# Altium project InfoDisplay.PrjPcb
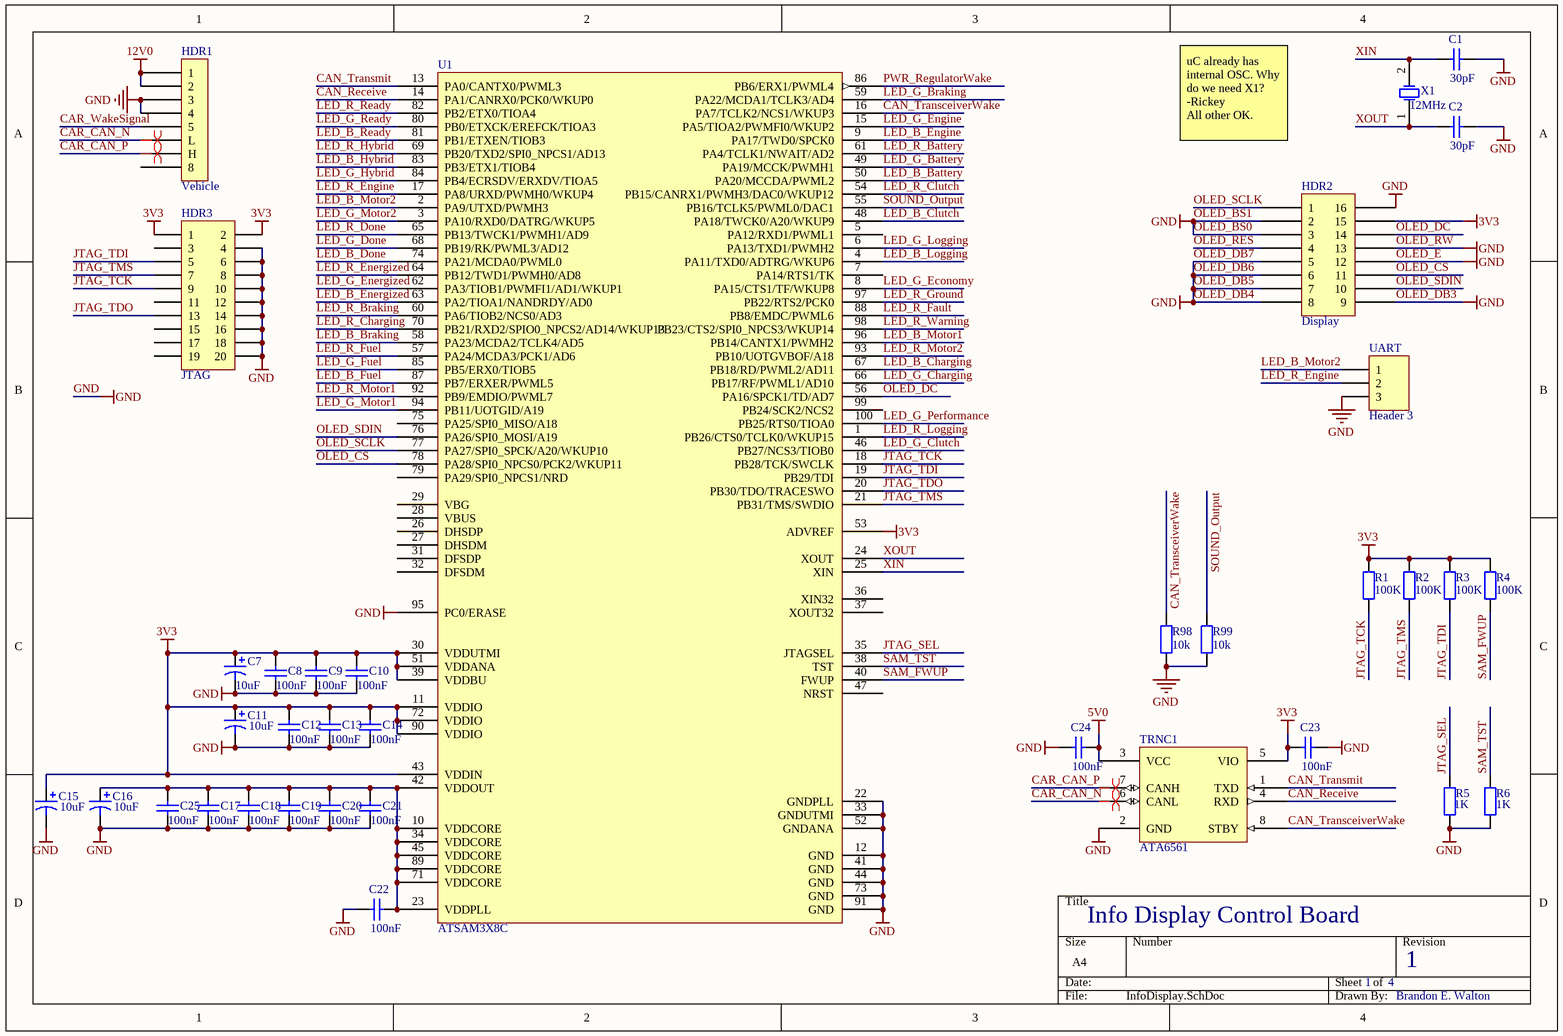
[diagram p0: InfoDisplay.SchDoc]
4 sheets, 219 parts. Net scope: global (net labels, ports and power ports of the same name join across sheets).
Board files: InfoDisplay.PcbDoc, InfoDisplayPreAutoRoute.PcbDoc, InfoDisplayPreReRoute.PcbDoc
Sheets:
  InfoDisplay.SchDoc
  InfoDisplayLEDs.SchDoc
  InfoDisplayAudio.SchDoc
  InfoDisplayPower.SchDoc

## Sheet InfoDisplay.SchDoc
size A4

### Parts
C1  value 30pF  [1608[0603]]  (hidden comment: CL10C300FB8NNNC)
C2  value 30pF  [1608[0603]]  (hidden comment: Cap)
C7  value 10uF  [CAPC3216M]  (hidden comment: Cap Pol1)
C8  value 100nF  [CAPC1608M]  (hidden comment: Cap)
C9  value 100nF  [CAPC1608M]  (hidden comment: Cap)
C10  value 100nF  [CAPC1608M]  (hidden comment: Cap)
C11  value 10uF  [CAPC3216M]  (hidden comment: Cap Pol1)
C12  value 100nF  [CAPC1608M]  (hidden comment: Cap)
C13  value 100nF  [CAPC1608M]  (hidden comment: Cap)
C14  value 100nF  [CAPC1608M]  (hidden comment: Cap)
C15  value 10uF  [CAPC3216M]  (hidden comment: Cap Pol1)
C16  value 10uF  [CAPC3216M]  (hidden comment: Cap Pol1)
C17  value 100nF  [CAPC1608M]  (hidden comment: Cap)
C18  value 100nF  [CAPC1608M]  (hidden comment: Cap)
C19  value 100nF  [CAPC1608M]  (hidden comment: Cap)
C20  value 100nF  [CAPC1608M]  (hidden comment: Cap)
C21  value 100nF  [CAPC1608M]  (hidden comment: Cap)
C22  value 100nF  [CAPC1608M]  (hidden comment: Cap)
C23  value 100nF  [CAPC1608M]  (hidden comment: Cap)
C24  value 100nF  [CAPC1608M]  (hidden comment: Cap)
C25  value 100nF  [CAPC1608M]  (hidden comment: Cap)
HDR1  Vehicle  [Molex_DuraClick_8Pin_Vertical]
HDR2  Display  [Molex_iGrid_16Pin_Vertical_Alt]
HDR3  JTAG  [HDR2X10]
R1  value 100K  [1608[0603]]  (hidden comment: Res2)
R2  value 100K  [1608[0603]]  (hidden comment: Res2)
R3  value 100K  [1608[0603]]  (hidden comment: Res2)
R4  value 100K  [1608[0603]]  (hidden comment: Res2)
R5  value 1K  [1608[0603]]  (hidden comment: Res2)
R6  value 1K  [1608[0603]]  (hidden comment: Res2)
R98  value 10k  [1608[0603]]  (hidden comment: RC0603JR-0710KL)
R99  value 10k  [1608[0603]]  (hidden comment: 311-10KGRCT-ND)
TRNC1  ATA6561  [SOP127P600X165-8M]
U1  ATSAM3X8C  [100-LQFP]
UART  Header 3  [HDR1X3]
X1  12MHz  [XTAL]

### Nets
3V3: C7.1 C8.1 C9.1 C10.1 C11.1 C12.1 C13.1 C14.1 C15.1 C23.2 HDR2.15 HDR3.1 HDR3.2 R1.2 R2.2 R3.2 R4.2 TRNC1.5(VIO) U1.11(VDDIO) U1.30(VDDUTMI) U1.39(VDDBU) U1.43(VDDIN) U1.51(VDDANA) U1.53(ADVREF) U1.72(VDDIO) U1.90(VDDIO)
5V0: C24.1 TRNC1.3(VCC)
12V0: HDR1.A1(1) HDR1.A2(2)
GND: C1.1 C2.1 C7.2 C8.2 C9.2 C10.2 C11.2 C12.2 C13.2 C14.2 C15.2 C16.2 C17.2 C18.2 C19.2 C20.2 C21.2 C22.2 C23.1 C24.2 C25.2 HDR1.A3(3) HDR1.A4(4) HDR2.2 HDR2.3 HDR2.5 HDR2.6 HDR2.7 HDR2.8 HDR2.9 HDR2.12 HDR2.13 HDR2.16 HDR3.4 HDR3.6 HDR3.8 HDR3.10 HDR3.12 HDR3.14 HDR3.16 HDR3.18 HDR3.20 R5.1 R6.1 R98.1 R99.1 TRNC1.2(GND) U1.12(GND) U1.22(GNDPLL) U1.33(GNDUTMI) U1.41(GND) U1.44(GND) U1.52(GNDANA) U1.73(GND) U1.91(GND) U1.95(PC0/ERASE) UART.3  [also labelled OLED_BS0, OLED_BS1, OLED_DB3, OLED_DB4, OLED_DB5, OLED_DB6, OLED_DB7, OLED_E, OLED_RW]
CAN_Receive: TRNC1.4(RXD) U1.14(PA1/CANRX0/PCK0/WKUP0)
CAN_TransceiverWake: R98.2 TRNC1.8(STBY) U1.16(PA7/TCLK2/NCS1/WKUP3)
CAN_Transmit: TRNC1.1(TXD) U1.13(PA0/CANTX0/PWML3)
CAR_CAN_N: HDR1.A6(L) TRNC1.6(CANL)
CAR_CAN_P: HDR1.A7(H) TRNC1.7(CANH)
CAR_WakeSignal: HDR1.A5(5)
JTAG_SEL: R5.2 U1.35(JTAGSEL)
JTAG_TCK: HDR3.9 R1.1 U1.18(PB28/TCK/SWCLK)
JTAG_TDI: HDR3.5 R3.1 U1.19(PB29/TDI)
JTAG_TDO: HDR3.13 U1.20(PB30/TDO/TRACESWO)
JTAG_TMS: HDR3.7 R2.1 U1.21(PB31/TMS/SWDIO)
LED_B_Battery: U1.50(PA20/MCCDA/PWML2)
LED_B_Braking: U1.58(PA23/MCDA2/TCLK4/AD5)
LED_B_Charging: U1.67(PB18/RD/PWML2/AD11)
LED_B_Clutch: U1.48(PA18/TWCK0/A20/WKUP9)
LED_B_Done: U1.74(PA21/MCDA0/PWML0)
LED_B_Energized: U1.63(PA2/TIOA1/NANDRDY/AD0)
LED_B_Engine: U1.9(PA17/TWD0/SPCK0)
LED_B_Fuel: U1.87(PB7/ERXER/PWML5)
LED_B_Hybrid: U1.83(PB3/ETX1/TIOB4)
LED_B_Logging: U1.4(PA11/TXD0/ADTRG/WKUP6)
LED_B_Motor1: U1.96(PB14/CANTX1/PWMH2)
LED_B_Motor2: U1.2(PA9/UTXD/PWMH3) UART.1
LED_B_Ready: U1.81(PB1/ETXEN/TIOB3)
LED_G_Battery: U1.49(PA19/MCCK/PWMH1)
LED_G_Braking: U1.59(PA22/MCDA1/TCLK3/AD4)
LED_G_Charging: U1.66(PB17/RF/PWML1/AD10)
LED_G_Clutch: U1.46(PB27/NCS3/TIOB0)
LED_G_Done: U1.68(PB19/RK/PWML3/AD12)
LED_G_Economy: U1.8(PA15/CTS1/TF/WKUP8)
LED_G_Energized: U1.62(PA3/TIOB1/PWMFI1/AD1/WKUP1)
LED_G_Engine: U1.15(PA5/TIOA2/PWMFI0/WKUP2)
LED_G_Fuel: U1.85(PB5/ERX0/TIOB5)
LED_G_Hybrid: U1.84(PB4/ECRSDV/ERXDV/TIOA5)
LED_G_Logging: U1.6(PA13/TXD1/PWMH2)
LED_G_Motor1: U1.94(PB11/UOTGID/A19)
LED_G_Motor2: U1.3(PA10/RXD0/DATRG/WKUP5)
LED_G_Performance: U1.100(PB25/RTS0/TIOA0)
LED_G_Ready: U1.80(PB0/ETXCK/EREFCK/TIOA3)
LED_R_Battery: U1.61(PA4/TCLK1/NWAIT/AD2)
LED_R_Braking: U1.60(PA6/TIOB2/NCS0/AD3)
LED_R_Charging: U1.70(PB21/RXD2/SPIO0_NPCS2/AD14/WKUP13)
LED_R_Clutch: U1.54(PB15/CANRX1/PWMH3/DAC0/WKUP12)
LED_R_Done: U1.65(PB13/TWCK1/PWMH1/AD9)
LED_R_Energized: U1.64(PB12/TWD1/PWMH0/AD8)
LED_R_Engine: U1.17(PA8/URXD/PWMH0/WKUP4) UART.2
LED_R_Fault: U1.88(PB8/EMDC/PWML6)
LED_R_Fuel: U1.57(PA24/MCDA3/PCK1/AD6)
LED_R_Ground: U1.97(PB22/RTS2/PCK0)
LED_R_Hybrid: U1.69(PB20/TXD2/SPI0_NPCS1/AD13)
LED_R_Logging: U1.1(PB26/CTS0/TCLK0/WKUP15)
LED_R_Motor1: U1.92(PB9/EMDIO/PWML7)
LED_R_Motor2: U1.93(PB10/UOTGVBOF/A18)
LED_R_Ready: U1.82(PB2/ETX0/TIOA4)
LED_R_Warning: U1.98(PB23/CTS2/SPI0_NPCS3/WKUP14)
OLED_CS: HDR2.11 U1.78(PA28/SPI0_NPCS0/PCK2/WKUP11)
OLED_DC: HDR2.14 U1.56(PA16/SPCK1/TD/AD7)
OLED_RES: HDR2.4
OLED_SCLK: HDR2.1 U1.77(PA27/SPI0_SPCK/A20/WKUP10)
OLED_SDIN: HDR2.10 U1.76(PA26/SPI0_MOSI/A19)
PWR_RegulatorWake: U1.86(PB6/ERX1/PWML4)
SAM_FWUP: R4.1 U1.40(FWUP)
SAM_TST: R6.2 U1.38(TST)
SOUND_Output: R99.2 U1.55(PB16/TCLK5/PWML0/DAC1)
XIN: C1.2 U1.25(XIN) X1.2(OSC2)
XOUT: C2.2 U1.24(XOUT) X1.1(OSC1)
NetC16_1: C16.1 C17.1 C18.1 C19.1 C20.1 C21.1 C22.1 C25.1 U1.10(VDDCORE) U1.23(VDDPLL) U1.34(VDDCORE) U1.42(VDDOUT) U1.45(VDDCORE) U1.71(VDDCORE) U1.89(VDDCORE)

Not connected (* = marked no-connect by the designer): HDR1 A8(8); HDR3 3 11 15 17 19; U1 5(PA12/RXD1/PWML1) 7(PA14/RTS1/TK) 26(DHSDP) 27(DHSDM) 28(VBUS) 29(VBG) 31(DFSDP) 32(DFSDM) 36(XIN32) 37(XOUT32) 47(NRST) 75(PA25/SPI0_MISO/A18) 79(PA29/SPI0_NPCS1/NRD) 99(PB24/SCK2/NCS2)

### Layout directives
differential pair: CAR_CAN_N, CAR_CAN_P

### Notes on the sheet
- uC already has internal OSC. Why do we need X1? -Rickey
  All other OK.
- Info Display Control Board
- 1
- 4
- Brandon E. Walton

### Library data of the parts
C1 = Cap: Capacitor; Published: 8-Jun-2000; LatestRevisionDate: 17-Jul-2002; LatestRevisionNote: Re-released for DXP Platform.; PackageReference: RAD-0.3; Publisher: Altium Limited; PackageDescription: Radial Cap, Thru-Hole; 2 Leads; 0.3 in Pin Spacing; Digikey: 1276-2259-1-ND; PartNumber: CL10C300FB8NNNC
C2 = Cap: Capacitor; PartNumber: CL10C300FB8NNNC; Published: 8-Jun-2000; LatestRevisionDate: 17-Jul-2002; LatestRevisionNote: Re-released for DXP Platform.; PackageReference: RAD-0.3; Publisher: Altium Limited; PackageDescription: Radial Cap, Thru-Hole; 2 Leads; 0.3 in Pin Spacing; Digikey: 1276-2259-1-ND; Manufacturer PartNo: CL10C300FB8NNNC
C7 C11 C16 = Cap Pol1: Polarized Capactior; Published: 8-Jun-2000; LatestRevisionDate: 17-Jul-2002; LatestRevisionNote: Re-released for DXP Platform.; PackageReference: RB7.6-15; Publisher: Altium Limited; PackageDescription: Polarized Capacitor (Radial); 2 Leads; Digikey: 495-2200-1-ND
C8-C10 C12-C14 C18-C25 = Cap: Capacitor; Partnumber: GRM188R71E104KA01D; Published: 8-Jun-2000; LatestRevisionDate: 17-Jul-2002; LatestRevisionNote: Re-released for DXP Platform.; PackageReference: RAD-0.3; Publisher: Altium Limited; PackageDescription: Radial Cap, Thru-Hole; 2 Leads; 0.3 in Pin Spacing; Digikey: 490-1524-1-ND
C15 = Cap Pol1: Polarized Capactior; PartNumber: T491A106K010ZT; Published: 8-Jun-2000; LatestRevisionDate: 17-Jul-2002; LatestRevisionNote: Re-released for DXP Platform.; PackageReference: RB7.6-15; Publisher: Altium Limited; PackageDescription: Polarized Capacitor (Radial); 2 Leads; Digikey: 495-2200-1-ND
C17 = Cap: Capacitor; PartNumber: GRM188R71E104KA01D; Published: 8-Jun-2000; LatestRevisionDate: 17-Jul-2002; LatestRevisionNote: Re-released for DXP Platform.; PackageReference: RAD-0.3; Publisher: Altium Limited; PackageDescription: Radial Cap, Thru-Hole; 2 Leads; 0.3 in Pin Spacing; Digikey: 490-1524-1-ND; Partnumber: GRM188R71E104KA01D
HDR1 = Molex_DuraClick_8Pin_Vertical: Molex iClick Series Connector, 8 Pin
HDR2 = Molex_iGrid_16Pin_Vertical: Molex iGrid Series Connector, 2 Row, 16 Pin
HDR3 = Header 10X2: JTAG Header, 10-Pin, Dual row, 2.56 pitch, Male; LatestRevisionDate: 17-Jul-2002; LatestRevisionNote: Re-released for DXP Platform.; Publisher: Altium Limited
R1-R4 = Res2: Resistor; PartNumber: MCT06030C1003FP500; Published: 8-Jun-2000; LatestRevisionDate: 17-Jul-2002; LatestRevisionNote: Re-released for DXP Platform.; PackageReference: AXIAL-0.4; Publisher: Altium Limited; PackageDescription: Axial Device, Thru-Hole; 2 Leads; 0.4 in Pin Spacing; Digikey: MCT0603-100K-CFCT-ND
R5 R6 = Res2: Resistor; PartNumber: MCT06030C1001FP500; Published: 8-Jun-2000; LatestRevisionDate: 17-Jul-2002; LatestRevisionNote: Re-released for DXP Platform.; PackageReference: AXIAL-0.4; Publisher: Altium Limited; PackageDescription: Axial Device, Thru-Hole; 2 Leads; 0.4 in Pin Spacing; Digikey: MCT0603-1.00K-CFCT-ND
R98 R99 = Res2: Resistor; Published: 8-Jun-2000; LatestRevisionDate: 17-Jul-2002; LatestRevisionNote: Re-released for DXP Platform.; PackageReference: AXIAL-0.4; Publisher: Altium Limited; PackageDescription: Axial Device, Thru-Hole; 2 Leads; 0.4 in Pin Spacing; Digikey: 311-10KGRCT-ND
TRNC1 = ATA6561: Atmel CAN Transceiver; Digikey: ATA6561; PartNumber: ATA6561
U1 = ATSAM3X8CA-AU: Atmel SAM Series Microcontroller; DigiKey: ATSAM3X8CA-AU-ND; PartNumber: ATSAM3X8CA-AU
UART = Header 3: Header, 3-Pin; LatestRevisionDate: 17-Jul-2002; LatestRevisionNote: Re-released for DXP Platform.; Publisher: Altium Limited
X1 = XTAL: 12MHz Crystal Oscillator; PartNumber: ECS-120-20-3X-EN-TR; Published: 8-Jun-2000; LatestRevisionDate: 17-Jul-2002; LatestRevisionNote: Re-released for DXP Platform.; PackageReference: R38; Publisher: Altium Limited; PackageDescription: Crystal, Thru-Hole; 2 Leads; Body 3.1 x 8.2 mm (Dia.xH); Digikey: XC1787CT-ND

## Sheet InfoDisplayLEDs.SchDoc
size A
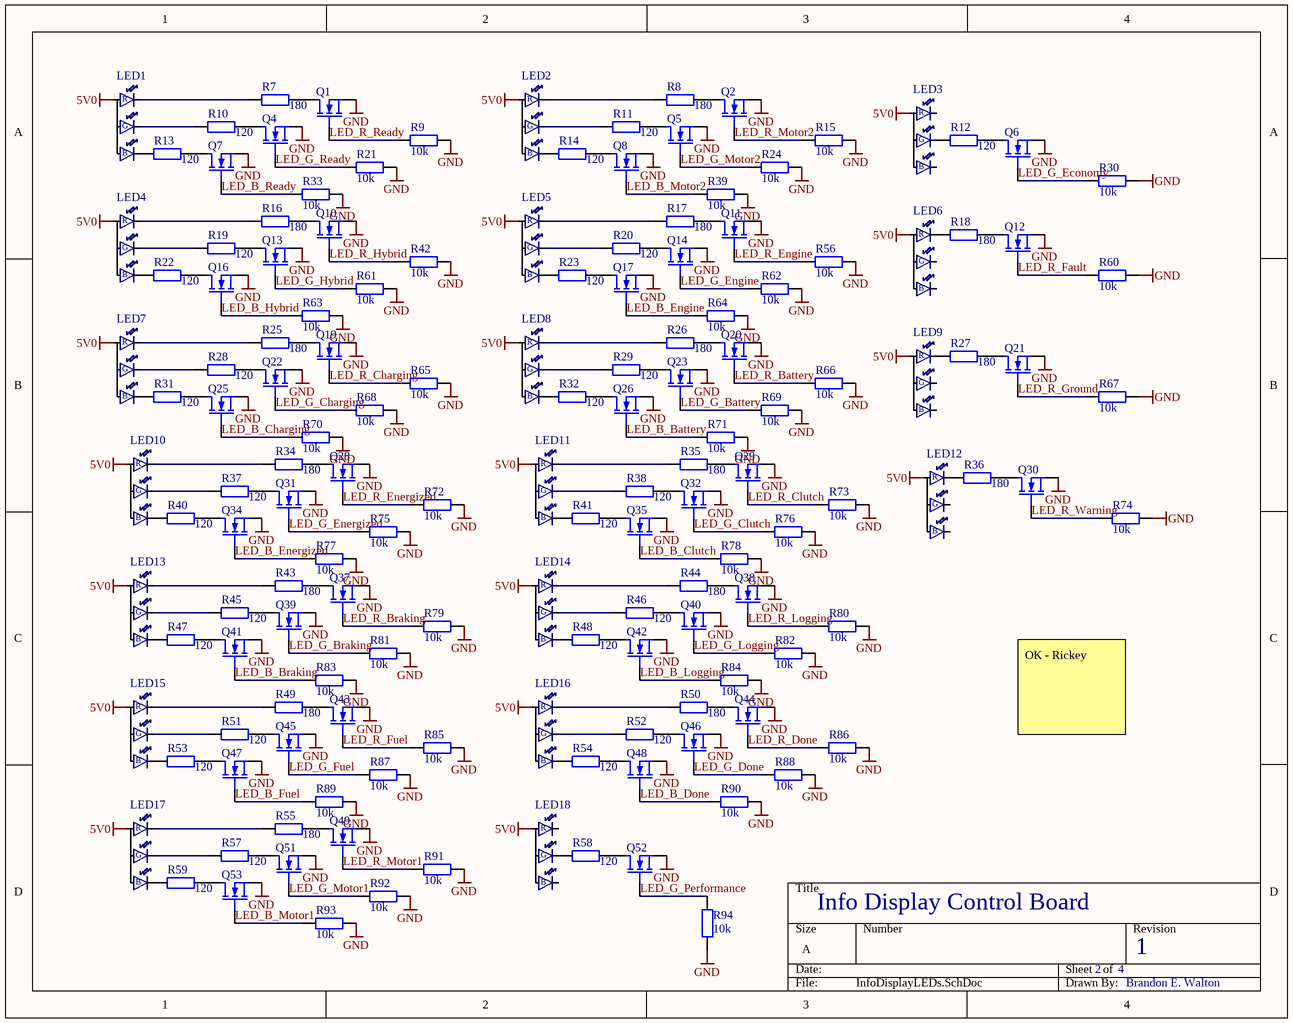
[diagram p1: InfoDisplayLEDs.SchDoc]

### Parts
LED1  LED  [CLVBA-FKA-CAEDH8BBB7A363CT-ND]  (value not drawn)
LED2  LED  [CLVBA-FKA-CAEDH8BBB7A363CT-ND]  (value not drawn)
LED3  LED  [CLVBA-FKA-CAEDH8BBB7A363CT-ND]  (value not drawn)
LED4  LED  [CLVBA-FKA-CAEDH8BBB7A363CT-ND]  (value not drawn)
LED5  LED  [CLVBA-FKA-CAEDH8BBB7A363CT-ND]  (value not drawn)
LED6  LED  [CLVBA-FKA-CAEDH8BBB7A363CT-ND]  (value not drawn)
LED7  LED  [CLVBA-FKA-CAEDH8BBB7A363CT-ND]  (value not drawn)
LED8  LED  [CLVBA-FKA-CAEDH8BBB7A363CT-ND]  (value not drawn)
LED9  LED  [CLVBA-FKA-CAEDH8BBB7A363CT-ND]  (value not drawn)
LED10  LED  [CLVBA-FKA-CAEDH8BBB7A363CT-ND]  (value not drawn)
LED11  LED  [CLVBA-FKA-CAEDH8BBB7A363CT-ND]  (value not drawn)
LED12  LED  [CLVBA-FKA-CAEDH8BBB7A363CT-ND]  (value not drawn)
LED13  LED  [CLVBA-FKA-CAEDH8BBB7A363CT-ND]  (value not drawn)
LED14  LED  [CLVBA-FKA-CAEDH8BBB7A363CT-ND]  (value not drawn)
LED15  LED  [CLVBA-FKA-CAEDH8BBB7A363CT-ND]  (value not drawn)
LED16  LED  [CLVBA-FKA-CAEDH8BBB7A363CT-ND]  (value not drawn)
LED17  LED  [CLVBA-FKA-CAEDH8BBB7A363CT-ND]  (value not drawn)
LED18  LED  [CLVBA-FKA-CAEDH8BBB7A363CT-ND]  (value not drawn)
Q1  MOSFET-N  [SOT50P160X110-3N]  (value not drawn)
Q2  MOSFET-N  [SOT50P160X110-3N]  (value not drawn)
Q4  MOSFET-N  [SOT50P160X110-3N]  (value not drawn)
Q5  MOSFET-N  [SOT50P160X110-3N]  (value not drawn)
Q6  MOSFET-N  [SOT50P160X110-3N]  (value not drawn)
Q7  MOSFET-N  [SOT50P160X110-3N]  (value not drawn)
Q8  MOSFET-N  [SOT50P160X110-3N]  (value not drawn)
Q10  MOSFET-N  [SOT50P160X110-3N]  (value not drawn)
Q11  MOSFET-N  [SOT50P160X110-3N]  (value not drawn)
Q12  MOSFET-N  [SOT50P160X110-3N]  (value not drawn)
Q13  MOSFET-N  [SOT50P160X110-3N]  (value not drawn)
Q14  MOSFET-N  [SOT50P160X110-3N]  (value not drawn)
Q16  MOSFET-N  [SOT50P160X110-3N]  (value not drawn)
Q17  MOSFET-N  [SOT50P160X110-3N]  (value not drawn)
Q19  MOSFET-N  [SOT50P160X110-3N]  (value not drawn)
Q20  MOSFET-N  [SOT50P160X110-3N]  (value not drawn)
Q21  MOSFET-N  [SOT50P160X110-3N]  (value not drawn)
Q22  MOSFET-N  [SOT50P160X110-3N]  (value not drawn)
Q23  MOSFET-N  [SOT50P160X110-3N]  (value not drawn)
Q25  MOSFET-N  [SOT50P160X110-3N]  (value not drawn)
Q26  MOSFET-N  [SOT50P160X110-3N]  (value not drawn)
Q28  MOSFET-N  [SOT50P160X110-3N]  (value not drawn)
Q29  MOSFET-N  [SOT50P160X110-3N]  (value not drawn)
Q30  MOSFET-N  [SOT50P160X110-3N]  (value not drawn)
Q31  MOSFET-N  [SOT50P160X110-3N]  (value not drawn)
Q32  MOSFET-N  [SOT50P160X110-3N]  (value not drawn)
Q34  MOSFET-N  [SOT50P160X110-3N]  (value not drawn)
Q35  MOSFET-N  [SOT50P160X110-3N]  (value not drawn)
Q37  MOSFET-N  [SOT50P160X110-3N]  (value not drawn)
Q38  MOSFET-N  [SOT50P160X110-3N]  (value not drawn)
Q39  MOSFET-N  [SOT50P160X110-3N]  (value not drawn)
Q40  MOSFET-N  [SOT50P160X110-3N]  (value not drawn)
Q41  MOSFET-N  [SOT50P160X110-3N]  (value not drawn)
Q42  MOSFET-N  [SOT50P160X110-3N]  (value not drawn)
Q43  MOSFET-N  [SOT50P160X110-3N]  (value not drawn)
Q44  MOSFET-N  [SOT50P160X110-3N]  (value not drawn)
Q45  MOSFET-N  [SOT50P160X110-3N]  (value not drawn)
Q46  MOSFET-N  [SOT50P160X110-3N]  (value not drawn)
Q47  MOSFET-N  [SOT50P160X110-3N]  (value not drawn)
Q48  MOSFET-N  [SOT50P160X110-3N]  (value not drawn)
Q49  MOSFET-N  [SOT50P160X110-3N]  (value not drawn)
Q51  MOSFET-N  [SOT50P160X110-3N]  (value not drawn)
Q52  MOSFET-N  [SOT50P160X110-3N]  (value not drawn)
Q53  MOSFET-N  [SOT50P160X110-3N]  (value not drawn)
R7  value 180  [1608[0603]]  (hidden comment: Res2)
R8  value 180  [1608[0603]]  (hidden comment: Res2)
R9  value 10k  [1608[0603]]  (hidden comment: 311-10KGRCT-ND)
R10  value 120  [1608[0603]]  (hidden comment: Res2)
R11  value 120  [1608[0603]]  (hidden comment: Res2)
R12  value 120  [1608[0603]]  (hidden comment: Res2)
R13  value 120  [1608[0603]]  (hidden comment: Res2)
R14  value 120  [1608[0603]]  (hidden comment: Res2)
R15  value 10k  [1608[0603]]  (hidden comment: 311-10KGRCT-ND)
R16  value 180  [1608[0603]]  (hidden comment: Res2)
R17  value 180  [1608[0603]]  (hidden comment: Res2)
R18  value 180  [1608[0603]]  (hidden comment: Res2)
R19  value 120  [1608[0603]]  (hidden comment: Res2)
R20  value 120  [1608[0603]]  (hidden comment: Res2)
R21  value 10k  [1608[0603]]  (hidden comment: 311-10KGRCT-ND)
R22  value 120  [1608[0603]]  (hidden comment: Res2)
R23  value 120  [1608[0603]]  (hidden comment: Res2)
R24  value 10k  [1608[0603]]  (hidden comment: 311-10KGRCT-ND)
R25  value 180  [1608[0603]]  (hidden comment: Res2)
R26  value 180  [1608[0603]]  (hidden comment: Res2)
R27  value 180  [1608[0603]]  (hidden comment: Res2)
R28  value 120  [1608[0603]]  (hidden comment: Res2)
R29  value 120  [1608[0603]]  (hidden comment: Res2)
R30  value 10k  [1608[0603]]  (hidden comment: 311-10KGRCT-ND)
R31  value 120  [1608[0603]]  (hidden comment: Res2)
R32  value 120  [1608[0603]]  (hidden comment: Res2)
R33  value 10k  [1608[0603]]  (hidden comment: 311-10KGRCT-ND)
R34  value 180  [1608[0603]]  (hidden comment: Res2)
R35  value 180  [1608[0603]]  (hidden comment: Res2)
R36  value 180  [1608[0603]]  (hidden comment: Res2)
R37  value 120  [1608[0603]]  (hidden comment: Res2)
R38  value 120  [1608[0603]]  (hidden comment: Res2)
R39  value 10k  [1608[0603]]  (hidden comment: 311-10KGRCT-ND)
R40  value 120  [1608[0603]]  (hidden comment: Res2)
R41  value 120  [1608[0603]]  (hidden comment: Res2)
R42  value 10k  [1608[0603]]  (hidden comment: 311-10KGRCT-ND)
R43  value 180  [1608[0603]]  (hidden comment: Res2)
R44  value 180  [1608[0603]]  (hidden comment: Res2)
R45  value 120  [1608[0603]]  (hidden comment: Res2)
R46  value 120  [1608[0603]]  (hidden comment: Res2)
R47  value 120  [1608[0603]]  (hidden comment: Res2)
R48  value 120  [1608[0603]]  (hidden comment: Res2)
R49  value 180  [1608[0603]]  (hidden comment: Res2)
R50  value 180  [1608[0603]]  (hidden comment: Res2)
R51  value 120  [1608[0603]]  (hidden comment: Res2)
R52  value 120  [1608[0603]]  (hidden comment: Res2)
R53  value 120  [1608[0603]]  (hidden comment: Res2)
R54  value 120  [1608[0603]]  (hidden comment: Res2)
R55  value 180  [1608[0603]]  (hidden comment: Res2)
R56  value 10k  [1608[0603]]  (hidden comment: 311-10KGRCT-ND)
R57  value 120  [1608[0603]]  (hidden comment: Res2)
R58  value 120  [1608[0603]]  (hidden comment: Res2)
R59  value 120  [1608[0603]]  (hidden comment: Res2)
R60  value 10k  [1608[0603]]  (hidden comment: 311-10KGRCT-ND)
R61  value 10k  [1608[0603]]  (hidden comment: 311-10KGRCT-ND)
R62  value 10k  [1608[0603]]  (hidden comment: 311-10KGRCT-ND)
R63  value 10k  [1608[0603]]  (hidden comment: 311-10KGRCT-ND)
R64  value 10k  [1608[0603]]  (hidden comment: 311-10KGRCT-ND)
R65  value 10k  [1608[0603]]  (hidden comment: 311-10KGRCT-ND)
R66  value 10k  [1608[0603]]  (hidden comment: 311-10KGRCT-ND)
R67  value 10k  [1608[0603]]  (hidden comment: 311-10KGRCT-ND)
R68  value 10k  [1608[0603]]  (hidden comment: 311-10KGRCT-ND)
R69  value 10k  [1608[0603]]  (hidden comment: 311-10KGRCT-ND)
R70  value 10k  [1608[0603]]  (hidden comment: 311-10KGRCT-ND)
R71  value 10k  [1608[0603]]  (hidden comment: 311-10KGRCT-ND)
R72  value 10k  [1608[0603]]  (hidden comment: 311-10KGRCT-ND)
R73  value 10k  [1608[0603]]  (hidden comment: 311-10KGRCT-ND)
R74  value 10k  [1608[0603]]  (hidden comment: 311-10KGRCT-ND)
R75  value 10k  [1608[0603]]  (hidden comment: 311-10KGRCT-ND)
R76  value 10k  [1608[0603]]  (hidden comment: 311-10KGRCT-ND)
R77  value 10k  [1608[0603]]  (hidden comment: 311-10KGRCT-ND)
R78  value 10k  [1608[0603]]  (hidden comment: 311-10KGRCT-ND)
R79  value 10k  [1608[0603]]  (hidden comment: 311-10KGRCT-ND)
R80  value 10k  [1608[0603]]  (hidden comment: 311-10KGRCT-ND)
R81  value 10k  [1608[0603]]  (hidden comment: 311-10KGRCT-ND)
R82  value 10k  [1608[0603]]  (hidden comment: 311-10KGRCT-ND)
R83  value 10k  [1608[0603]]  (hidden comment: 311-10KGRCT-ND)
R84  value 10k  [1608[0603]]  (hidden comment: 311-10KGRCT-ND)
R85  value 10k  [1608[0603]]  (hidden comment: 311-10KGRCT-ND)
R86  value 10k  [1608[0603]]  (hidden comment: 311-10KGRCT-ND)
R87  value 10k  [1608[0603]]  (hidden comment: 311-10KGRCT-ND)
R88  value 10k  [1608[0603]]  (hidden comment: 311-10KGRCT-ND)
R89  value 10k  [1608[0603]]  (hidden comment: 311-10KGRCT-ND)
R90  value 10k  [1608[0603]]  (hidden comment: 311-10KGRCT-ND)
R91  value 10k  [1608[0603]]  (hidden comment: 311-10KGRCT-ND)
R92  value 10k  [1608[0603]]  (hidden comment: 311-10KGRCT-ND)
R93  value 10k  [1608[0603]]  (hidden comment: 311-10KGRCT-ND)
R94  value 10k  [1608[0603]]  (hidden comment: 311-10KGRCT-ND)

### Nets
5V0: LED1.2(COMMON) LED2.2(COMMON) LED3.2(COMMON) LED4.2(COMMON) LED5.2(COMMON) LED6.2(COMMON) LED7.2(COMMON) LED8.2(COMMON) LED9.2(COMMON) LED10.2(COMMON) LED11.2(COMMON) LED12.2(COMMON) LED13.2(COMMON) LED14.2(COMMON) LED15.2(COMMON) LED16.2(COMMON) LED17.2(COMMON) LED18.2(COMMON)
GND: Q1.3(S) Q2.3(S) Q4.3(S) Q5.3(S) Q6.3(S) Q7.3(S) Q8.3(S) Q10.3(S) Q11.3(S) Q12.3(S) Q13.3(S) Q14.3(S) Q16.3(S) Q17.3(S) Q19.3(S) Q20.3(S) Q21.3(S) Q22.3(S) Q23.3(S) Q25.3(S) Q26.3(S) Q28.3(S) Q29.3(S) Q30.3(S) Q31.3(S) Q32.3(S) Q34.3(S) Q35.3(S) Q37.3(S) Q38.3(S) Q39.3(S) Q40.3(S) Q41.3(S) Q42.3(S) Q43.3(S) Q44.3(S) Q45.3(S) Q46.3(S) Q47.3(S) Q48.3(S) Q49.3(S) Q51.3(S) Q52.3(S) Q53.3(S) R9.2 R15.2 R21.2 R24.2 R30.1 R33.2 R39.2 R42.2 R56.2 R60.2 R61.2 R62.2 R63.2 R64.2 R65.2 R66.2 R67.2 R68.2 R69.2 R70.2 R71.2 R72.2 R73.2 R74.2 R75.2 R76.2 R77.2 R78.2 R79.2 R80.2 R81.2 R82.2 R83.2 R84.2 R85.2 R86.2 R87.2 R88.2 R89.2 R90.2 R91.2 R92.2 R93.2 R94.1
LED_B_Battery: Q26.2(G) R71.1
LED_B_Braking: Q41.2(G) R83.1
LED_B_Charging: Q25.2(G) R70.1
LED_B_Clutch: Q35.2(G) R78.1
LED_B_Done: Q48.2(G) R90.1
LED_B_Energized: Q34.2(G) R77.1
LED_B_Engine: Q17.2(G) R64.1
LED_B_Fuel: Q47.2(G) R89.1
LED_B_Hybrid: Q16.2(G) R63.1
LED_B_Logging: Q42.2(G) R84.1
LED_B_Motor1: Q53.2(G) R93.1
LED_B_Motor2: Q8.2(G) R39.1
LED_B_Ready: Q7.2(G) R33.1
LED_G_Battery: Q23.2(G) R69.1
LED_G_Braking: Q39.2(G) R81.1
LED_G_Charging: Q22.2(G) R68.1
LED_G_Clutch: Q32.2(G) R76.1
LED_G_Done: Q46.2(G) R88.1
LED_G_Economy: Q6.2(G) R30.2
LED_G_Energized: Q31.2(G) R75.1
LED_G_Engine: Q14.2(G) R62.1
LED_G_Fuel: Q45.2(G) R87.1
LED_G_Hybrid: Q13.2(G) R61.1
LED_G_Logging: Q40.2(G) R82.1
LED_G_Motor1: Q51.2(G) R92.1
LED_G_Motor2: Q5.2(G) R24.1
LED_G_Performance: Q52.2(G) R94.2
LED_G_Ready: Q4.2(G) R21.1
LED_R_Battery: Q20.2(G) R66.1
LED_R_Braking: Q37.2(G) R79.1
LED_R_Charging: Q19.2(G) R65.1
LED_R_Clutch: Q29.2(G) R73.1
LED_R_Done: Q44.2(G) R86.1
LED_R_Energized: Q28.2(G) R72.1
LED_R_Engine: Q11.2(G) R56.1
LED_R_Fault: Q12.2(G) R60.1
LED_R_Fuel: Q43.2(G) R85.1
LED_R_Ground: Q21.2(G) R67.1
LED_R_Hybrid: Q10.2(G) R42.1
LED_R_Logging: Q38.2(G) R80.1
LED_R_Motor1: Q49.2(G) R91.1
LED_R_Motor2: Q2.2(G) R15.1
LED_R_Ready: Q1.2(G) R9.1
LED_R_Warning: Q30.2(G) R74.1
NetLED1_1: LED1.1(RED) R7.2
NetLED1_3: LED1.3(BLUE) R13.2
NetLED1_4: LED1.4(GREEN) R10.2
NetLED2_1: LED2.1(RED) R8.2
NetLED2_3: LED2.3(BLUE) R14.2
NetLED2_4: LED2.4(GREEN) R11.2
NetLED3_4: LED3.4(GREEN) R12.2
NetLED4_1: LED4.1(RED) R16.2
NetLED4_3: LED4.3(BLUE) R22.2
NetLED4_4: LED4.4(GREEN) R19.2
NetLED5_1: LED5.1(RED) R17.2
NetLED5_3: LED5.3(BLUE) R23.2
NetLED5_4: LED5.4(GREEN) R20.2
NetLED6_1: LED6.1(RED) R18.2
NetLED7_1: LED7.1(RED) R25.2
NetLED7_3: LED7.3(BLUE) R31.2
NetLED7_4: LED7.4(GREEN) R28.2
NetLED8_1: LED8.1(RED) R26.2
NetLED8_3: LED8.3(BLUE) R32.2
NetLED8_4: LED8.4(GREEN) R29.2
NetLED9_1: LED9.1(RED) R27.2
NetLED10_1: LED10.1(RED) R34.2
NetLED10_3: LED10.3(BLUE) R40.2
NetLED10_4: LED10.4(GREEN) R37.2
NetLED11_1: LED11.1(RED) R35.2
NetLED11_3: LED11.3(BLUE) R41.2
NetLED11_4: LED11.4(GREEN) R38.2
NetLED12_1: LED12.1(RED) R36.2
NetLED13_1: LED13.1(RED) R43.2
NetLED13_3: LED13.3(BLUE) R47.2
NetLED13_4: LED13.4(GREEN) R45.2
NetLED14_1: LED14.1(RED) R44.2
NetLED14_3: LED14.3(BLUE) R48.2
NetLED14_4: LED14.4(GREEN) R46.2
NetLED15_1: LED15.1(RED) R49.2
NetLED15_3: LED15.3(BLUE) R53.2
NetLED15_4: LED15.4(GREEN) R51.2
NetLED16_1: LED16.1(RED) R50.2
NetLED16_3: LED16.3(BLUE) R54.2
NetLED16_4: LED16.4(GREEN) R52.2
NetLED17_1: LED17.1(RED) R55.2
NetLED17_3: LED17.3(BLUE) R59.2
NetLED17_4: LED17.4(GREEN) R57.2
NetLED18_4: LED18.4(GREEN) R58.2
NetQ1_1: Q1.1(D) R7.1
NetQ2_1: Q2.1(D) R8.1
NetQ4_1: Q4.1(D) R10.1
NetQ5_1: Q5.1(D) R11.1
NetQ6_1: Q6.1(D) R12.1
NetQ7_1: Q7.1(D) R13.1
NetQ8_1: Q8.1(D) R14.1
NetQ10_1: Q10.1(D) R16.1
NetQ11_1: Q11.1(D) R17.1
NetQ12_1: Q12.1(D) R18.1
NetQ13_1: Q13.1(D) R19.1
NetQ14_1: Q14.1(D) R20.1
NetQ16_1: Q16.1(D) R22.1
NetQ17_1: Q17.1(D) R23.1
NetQ19_1: Q19.1(D) R25.1
NetQ20_1: Q20.1(D) R26.1
NetQ21_1: Q21.1(D) R27.1
NetQ22_1: Q22.1(D) R28.1
NetQ23_1: Q23.1(D) R29.1
NetQ25_1: Q25.1(D) R31.1
NetQ26_1: Q26.1(D) R32.1
NetQ28_1: Q28.1(D) R34.1
NetQ29_1: Q29.1(D) R35.1
NetQ30_1: Q30.1(D) R36.1
NetQ31_1: Q31.1(D) R37.1
NetQ32_1: Q32.1(D) R38.1
NetQ34_1: Q34.1(D) R40.1
NetQ35_1: Q35.1(D) R41.1
NetQ37_1: Q37.1(D) R43.1
NetQ38_1: Q38.1(D) R44.1
NetQ39_1: Q39.1(D) R45.1
NetQ40_1: Q40.1(D) R46.1
NetQ41_1: Q41.1(D) R47.1
NetQ42_1: Q42.1(D) R48.1
NetQ43_1: Q43.1(D) R49.1
NetQ44_1: Q44.1(D) R50.1
NetQ45_1: Q45.1(D) R51.1
NetQ46_1: Q46.1(D) R52.1
NetQ47_1: Q47.1(D) R53.1
NetQ48_1: Q48.1(D) R54.1
NetQ49_1: Q49.1(D) R55.1
NetQ51_1: Q51.1(D) R57.1
NetQ52_1: Q52.1(D) R58.1
NetQ53_1: Q53.1(D) R59.1

Not connected (* = marked no-connect by the designer): LED3 1(RED) 3(BLUE); LED6 3(BLUE) 4(GREEN); LED9 3(BLUE) 4(GREEN); LED12 3(BLUE) 4(GREEN); LED18 1(RED) 3(BLUE)

### Notes on the sheet
- OK - Rickey
- Info Display Control Board
- 2
- 4
- 1
- Brandon E. Walton
- (in symbol LED) R; G; B

### Library data of the parts
LED1 = LED: LED RGB; PartNumber: CLVBA-FKA-CAEDH8BBB7A363; Digikey: CLVBA-FKA-CAEDH8BBB7A363CT-ND
Q1 Q2 Q4-Q8 Q10-Q14 Q16 Q17 Q19-Q23 Q25 Q26 Q28-Q31 Q34 Q35 Q37-Q49 Q51-Q53 = MOSFET-N: N-Channel MOSFET; Published: 8-Jun-2000; LatestRevisionDate: 17-Jul-2002; LatestRevisionNote: Re-released for DXP Platform.; PackageVersion: 1995/1996; PackageReference: E3; Publisher: Altium Limited; PackageDescription: TO, Flat Index; 3 In-Line, Axial Leads; Body Dia. 4.6mm; Lead Dia. 0.5 mm (max); Digikey: SSM3K15AFSLFCT-ND
Q32 = MOSFET-N: N-Channel MOSFET; PartNumber: SSM3K15AFS,LF; Published: 8-Jun-2000; LatestRevisionDate: 17-Jul-2002; LatestRevisionNote: Re-released for DXP Platform.; PackageVersion: 1995/1996; PackageReference: E3; Publisher: Altium Limited; PackageDescription: TO, Flat Index; 3 In-Line, Axial Leads; Body Dia. 4.6mm; Lead Dia. 0.5 mm (max); Digikey: SSM3K15AFSLFCT-ND
R7-R34 R36-R40 R42-R94 = Res2: Resistor; Published: 8-Jun-2000; LatestRevisionDate: 17-Jul-2002; LatestRevisionNote: Re-released for DXP Platform.; PackageReference: AXIAL-0.4; Publisher: Altium Limited; PackageDescription: Axial Device, Thru-Hole; 2 Leads; 0.4 in Pin Spacing
  R7 R8 R16-R18 R25-R27 R34 R36 R43 R44 R49 R50 R55: Digikey: RNCP0603FTD180RCT-ND
  R9 R15 R21 R24 R30 R33 R39 R42 R56 R60-R94: Digikey: 311-10KGRCT-ND
  R10-R14 R19 R20 R22 R23 R28 R29 R31 R32 R37 R38 R40 R45-R48 R51-R54 R57-R59: Digikey: 311-120GRCT-ND
R35 = Res2: Resistor; PartNumber: ESR03EZPJ101; Published: 8-Jun-2000; LatestRevisionDate: 17-Jul-2002; LatestRevisionNote: Re-released for DXP Platform.; PackageReference: AXIAL-0.4; Publisher: Altium Limited; PackageDescription: Axial Device, Thru-Hole; 2 Leads; 0.4 in Pin Spacing; Digikey: RNCP0603FTD180RCT-ND
R41 = Res2: Resistor; PartNumber: CRCW120622R0JNEA; Published: 8-Jun-2000; LatestRevisionDate: 17-Jul-2002; LatestRevisionNote: Re-released for DXP Platform.; PackageReference: AXIAL-0.4; Publisher: Altium Limited; PackageDescription: Axial Device, Thru-Hole; 2 Leads; 0.4 in Pin Spacing; Digikey: 311-120GRCT-ND
LED2-LED18 = LED: Digikey: CLVBA-FKA-CAEDH8BBB7A363CT-ND

## Sheet InfoDisplayAudio.SchDoc
size A
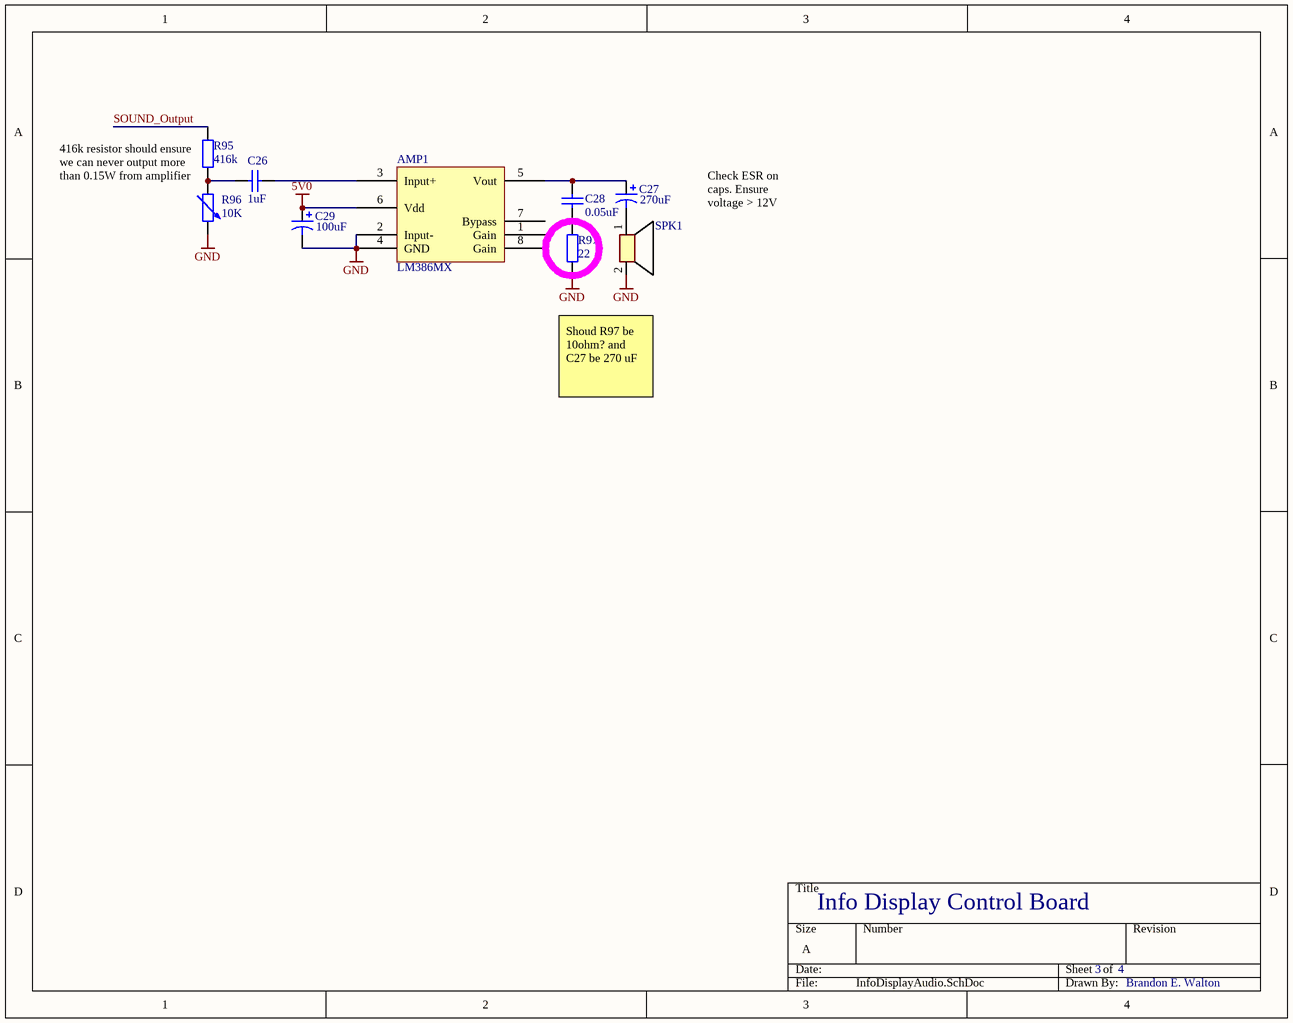
[diagram p2: InfoDisplayAudio.SchDoc]

### Parts
AMP1  LM386MX  [SOIC127P600X173-8N]
C26  value 1uF  [CAPC1005N]  (hidden comment: GRM155R60J105KE19D)
C27  value 270uF  [EEU-FR1A271]  (hidden comment: EEU-FR1A271)
C28  value 0.05uF  [RESC0603N]  (hidden comment: GRM033R61E472KA12D)
C29  value 100uF  [CAPC3216M]  (hidden comment: F930J107MAA)
R95  value 416k  [1608[0603]]  (hidden comment: RC0603FR-07422KL)
R96  value 10K  [PVZ3A103C01R00]  (hidden comment: PVZ3A103C01R00)
R97  value 22  [1608[0603]]  (hidden comment: Res2)
SPK1  PUI AST-03008MR-R  [AST-03008MR-R]  (value not drawn)

### Nets
5V0: AMP1.6(Vdd) C29.1
GND: AMP1.2(Input-) AMP1.4(GND) C29.2 R96.2 R97.2 SPK1.2
SOUND_Output: R95.2
NetAMP1_3: AMP1.3(Input+) C26.2
NetAMP1_5: AMP1.5(Vout) C27.1 C28.2
NetC26_1: C26.1 R95.1 R96.1
NetC27_2: C27.2 SPK1.1
NetC28_1: C28.1 R97.1

Not connected (* = marked no-connect by the designer): AMP1 1(Gain) 7(Bypass) 8(Gain)

### Notes on the sheet
- 416k resistor should ensure we can never output more than 0.15W from amplifier
- Check ESR on caps. Ensure voltage > 12V
- Shoud R97 be 10ohm? and C27 be 270 uF
- Info Display Control Board
- 3
- 4
- Brandon E. Walton

### Library data of the parts
AMP1 = LM386MX: TI Audio Amplifier, 0.350W, 5-12V; Partnumber: LM386MX-1/NOPB; Digikey: LM386MX-1/NOPBCT-ND
C26 C28 = Cap: Capacitor; Published: 8-Jun-2000; LatestRevisionDate: 17-Jul-2002; LatestRevisionNote: Re-released for DXP Platform.; PackageReference: RAD-0.3; Publisher: Altium Limited; PackageDescription: Radial Cap, Thru-Hole; 2 Leads; 0.3 in Pin Spacing
  C26: Digikey: 490-1320-1-ND; PartNumber: GRM155R60J105KE19D
  C28: Digikey: 490-9993-1-ND; PartNumber: GRM033R61E472KA12D
C27 C29 = Cap Pol1: Polarized Capactior; Published: 8-Jun-2000; LatestRevisionDate: 17-Jul-2002; LatestRevisionNote: Re-released for DXP Platform.; PackageReference: RB7.6-15; Publisher: Altium Limited; PackageDescription: Polarized Capacitor (Radial); 2 Leads
  C27: Digikey: P16745-ND; Partnumber: EEU-FR1A271
  C29: Digikey: 478-8155-1-ND; Partnumber: F930J107MAA
R95 = Res2: Resistor; Published: 8-Jun-2000; LatestRevisionDate: 17-Jul-2002; LatestRevisionNote: Re-released for DXP Platform.; PackageReference: AXIAL-0.4; Publisher: Altium Limited; PackageDescription: Axial Device, Thru-Hole; 2 Leads; 0.4 in Pin Spacing; Digikey: 311-422KHRCT-ND; Partnumber: RC0603FR-07422KL
R96 = Res Adj2: Variable Resistor; Set Position: 0.5; Published: 8-Jun-2000; LatestRevisionDate: 17-Jul-2002; LatestRevisionNote: Re-released for DXP Platform.; PackageReference: AXIAL-0.6; Publisher: Altium Limited; PackageDescription: Axial Device, Thru-Hole; 2 Leads; 0.6 in Pin Spacing; Digikey: 490-7005-1-ND; Partnumber: PVZ3A103C01R00
R97 = Res2: Resistor; PartNumber: CRCW120622R0JNEA; Published: 8-Jun-2000; LatestRevisionDate: 17-Jul-2002; LatestRevisionNote: Re-released for DXP Platform.; PackageReference: AXIAL-0.4; Publisher: Altium Limited; PackageDescription: Axial Device, Thru-Hole; 2 Leads; 0.4 in Pin Spacing; Digikey: 541-22ECT-ND
SPK1 = PUI AST-03008MR-R: PUI 0.15W Speaker, 8 Ohm; Digikey: 668-1136-ND; Partnumber: AST-03008MR-R

## Sheet InfoDisplayPower.SchDoc
size A
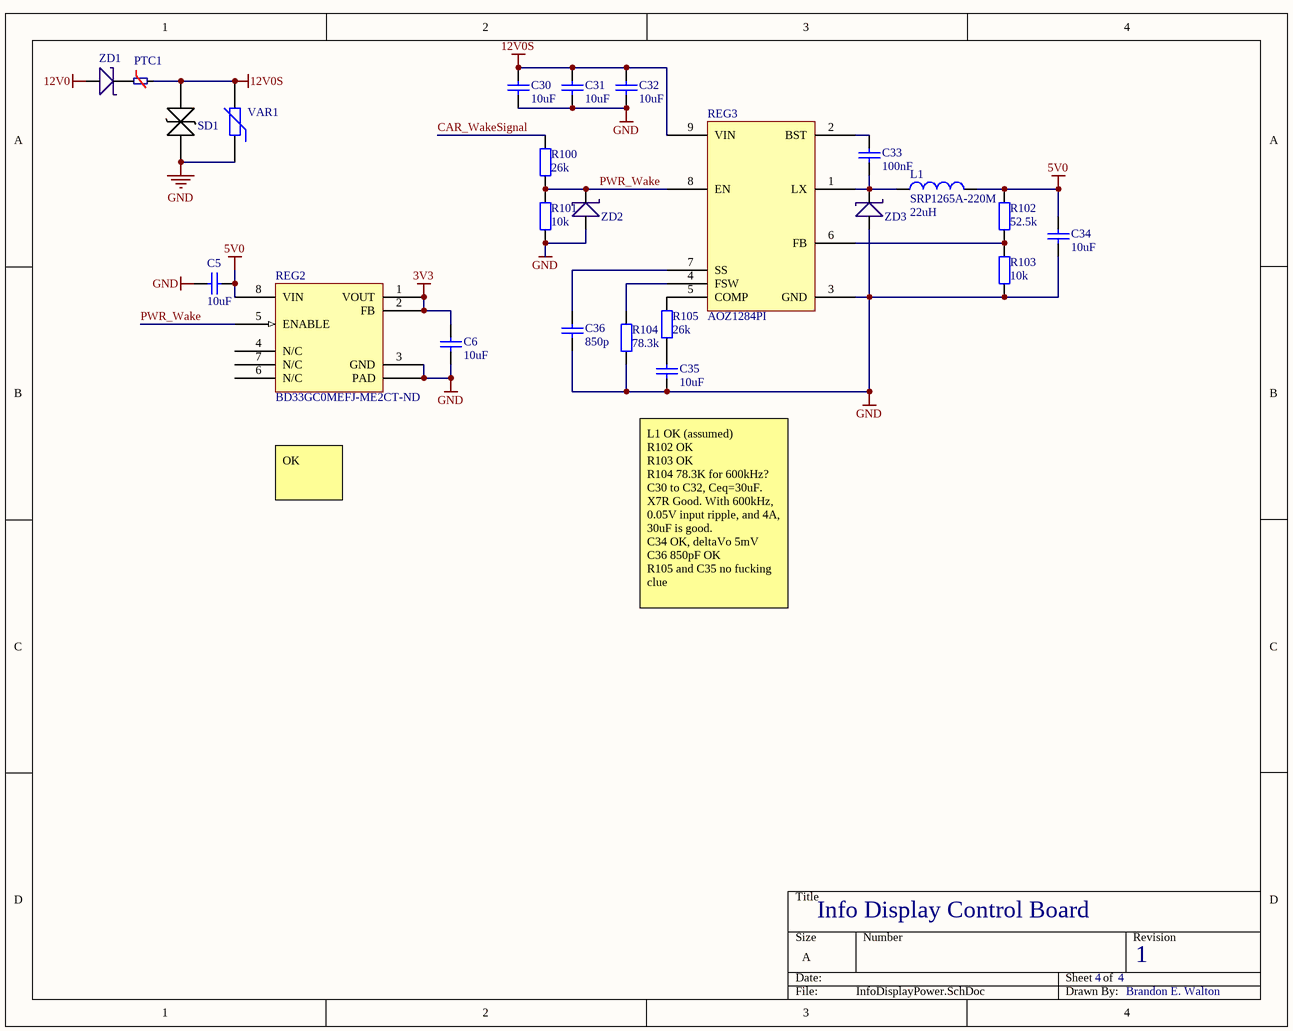
[diagram p3: InfoDisplayPower.SchDoc]

### Parts
C5  value 10uF  [CAPC3216M]  (hidden comment: CGA5L1X7R1E106K160AC)
C6  value 10uF  [CAPC3216M]  (hidden comment: CGA5L1X7R1E106K160AC)
C30  value 10uF  [CAPC3216M]  (hidden comment: CGA5L1X7R1E106K160AC)
C31  value 10uF  [CAPC3216M]  (hidden comment: CGA5L1X7R1E106K160AC)
C32  value 10uF  [CAPC3216M]  (hidden comment: CGA5L1X7R1E106K160AC)
C33  value 100nF  [CAPC1005M]  (hidden comment: GRM155R71C104KA88D)
C34  value 10uF  [CAPC3216M]  (hidden comment: CGA5L1X7R1E106K160AC)
C35  value 10uF  [CAPC3216M]  (hidden comment: CGA5L1X7R1E106K160AC)
C36  value 850p  [RESC0603L]  (hidden comment: GRM033R71E821KA01D)
L1  SRP1265A-220M  value 22uH  [SRP1265A-220M]
PTC1  0ZCF0200AF2C  [0ZCF0200AF2C]  (value not drawn)
R100  value 26k  [1608[0603]]  (hidden comment: MCT06030C2702FP500)
R101  value 10k  [1608[0603]]  (hidden comment: RC0603JR-0710KL)
R102  value 52.5k  [1608[0603]]  (hidden comment: RC0603FR-0752K3L)
R103  value 10k  [1608[0603]]  (hidden comment: RC0603JR-0710KL)
R104  value 78.3k  [RESC1005L]  (hidden comment: RC0402FR-0778K7L)
R105  value 26k  [1608[0603]]  (hidden comment: MCT06030C2702FP500)
REG2  BD33GC0MEFJ-ME2CT-ND  [TSOP127P600X100_HS-9M]
REG3  AOZ1284PI  [SOIC127P600X170_HS-9N]
SD1  UCLAMP1211P.TCT  [CAPC1005M]  (value not drawn)
VAR1  V10P14AUTO  [AXIAL-0.3]  (value not drawn)
ZD1  DB2430100L  [DB2430100L]  (value not drawn)
ZD2  MM3Z3V3ST1G  [SOIC127P250X100-2N]  (value not drawn)
ZD3  DB2431200L  [DB2431200L]  (value not drawn)

### Nets
3V3: C6.1 REG2.1(VOUT) REG2.2(FB)
5V0: C5.2 C34.1 L1.2 R102.2 REG2.8(VIN)
12V0: ZD1.A
12V0S: C30.1 C31.1 C32.1 PTC1.2 REG3.9(VIN) SD1.2 VAR1.2
GND: C5.1 C6.2 C30.2 C31.2 C32.2 C34.2 C35.2 C36.2 R101.1 R103.1 R104.1 REG2.3(GND) REG2.9(PAD) REG3.3(GND) SD1.1 VAR1.1 ZD2.A ZD3.A
CAR_WakeSignal: R100.2
PWR_Wake: R100.1 R101.2 REG2.5(ENABLE) REG3.8(EN) ZD2.K
NetC33_1: C33.1 REG3.2(BST)
NetC33_2: C33.2 L1.1 REG3.1(LX) ZD3.K
NetC35_1: C35.1 R105.1
NetC36_1: C36.1 REG3.7(SS)
NetPTC1_1: PTC1.1 ZD1.K
NetR102_1: R102.1 R103.2 REG3.6(FB)
NetR104_2: R104.2 REG3.4(FSW)
NetR105_2: R105.2 REG3.5(COMP)

Not connected (* = marked no-connect by the designer): REG2 4(N/C) 6(N/C) 7(N/C)

### Notes on the sheet
- OK
- (near C35) L1 OK (assumed)
  R102 OK
  R103 OK
  R104 78.3K for 600kHz?
  C30 to C32, Ceq=30uF. X7R Good. With 600kHz, 0.05V input ripple, and 4A, 30uF is good.
  C34 OK, deltaVo 5mV
  C36 850pF OK
  R105 and C35 no fucking clue
- Info Display Control Board
- 4
- 1
- Brandon E. Walton

### Library data of the parts
C5 C6 C30-C35 = Cap: Capacitor; Published: 8-Jun-2000; LatestRevisionDate: 17-Jul-2002; LatestRevisionNote: Re-released for DXP Platform.; PackageReference: RAD-0.3; Publisher: Altium Limited; PackageDescription: Radial Cap, Thru-Hole; 2 Leads; 0.3 in Pin Spacing
  C5 C6 C30-C32 C34 C35: Digikey: 445-6990-1-ND; PartNumber: CGA5L1X7R1E106K160AC
  C33: Digikey: 490-3261-1-ND; PartNumber: GRM155R71C104KA88D
C36 = Cap: Capacitor; PartNumber: CGA5L1X7R1E106K160AC; Published: 8-Jun-2000; LatestRevisionDate: 17-Jul-2002; LatestRevisionNote: Re-released for DXP Platform.; PackageReference: RAD-0.3; Publisher: Altium Limited; PackageDescription: Radial Cap, Thru-Hole; 2 Leads; 0.3 in Pin Spacing; Digikey: 490-3183-1-ND
L1 = Inductor: Code_IEC: 1005; Published: 8-Jun-2000; LatestRevisionDate: 29-May-2009; LatestRevisionNote: IPC-7351 Footprint Added.; PackageReference: 0402-A; Publisher: Altium Limited; PackageDescription: Chip Inductor; Code_JEITA: 0402; Digikey: SRP1265A-220MCT-ND; Partnumber: SRP1265A-220M
PTC1 = 0ZCF0200AF2C: PTC device, 2A hold, 4A trip; Digikey: 507-1749-1-ND; Manufacturer PartNo: 0ZCF0200AF2C
R100-R105 = Res2: Resistor; Partnumber: RC0603FR-07422KL; Published: 8-Jun-2000; LatestRevisionDate: 17-Jul-2002; LatestRevisionNote: Re-released for DXP Platform.; PackageReference: AXIAL-0.4; Publisher: Altium Limited; PackageDescription: Axial Device, Thru-Hole; 2 Leads; 0.4 in Pin Spacing
  R100 R105: Digikey: MCT0603-27.0K-CFCT-ND
  R101 R103: Digikey: 311-10KGRCT-ND
  R102: Digikey: 311-52.3KHRCT-ND
  R104: Digikey: 311-78.7KLRCT-ND
REG2 = BD33GC0MEFJ-ME2CT-ND: Rohm 3.3V LDO; Digikey: BD33GC0MEFJ-ME2CT-ND; Partnumber: BD33GC0MEFJ-ME2
REG3 = AOZ1284PI: A&M 4A Buck Regulator, 0.8 to 30V; Manufacturer PartNo: AOZ1284PI; Digikey: 785-1689-1-ND
SD1 = UCLAMP0511PQTCT: Semtech TVS Diode; Digikey: UCLAMP1211PCT-ND; PartNumber: UCLAMP1211P.TCT
VAR1 = Res Varistor: Varistor (Voltage-Sensitive Resistor); Published: 24-Mar-1999; LatestRevisionDate: 29-May-2009; LatestRevisionNote: IPC-7351 Footprint Added.; PackageVersion: Mar-2003; PackageReference: 6-0805; Publisher: Altium Limited; PackageDescription: Chip Resistor 0805 Case Size; Code_IPC: RESC2012; Digikey: F6413-ND; Partnumber: V10P14AUTO
ZD1 = DB2430100L: Panasonic Schottky Diode, 2A; Digikey: DB2430100LCT-ND; Partnumber: DB2430100L
ZD2 = DB2430100L: 3.3V Zener Diode; Digikey: MM3Z3V3ST1GOSCT-ND; Partnumber: MM3Z3V3ST1G
ZD3 = DB2430100L: Shottky Diode, 5A, 30V, 510 mV; Digikey: DB2431200LCT-ND; Partnumber: DB2431200L

## Nets that join several sheets
3V3: InfoDisplay (26 pins), InfoDisplayPower (C6.1 REG2.1 REG2.2)
5V0: InfoDisplay (C24.1 TRNC1.3), InfoDisplayLEDs (18 pins), InfoDisplayAudio (AMP1.6 C29.1), InfoDisplayPower (5 pins)
12V0: InfoDisplay (HDR1.A1 HDR1.A2), InfoDisplayPower (ZD1.A)
GND: InfoDisplay (57 pins), InfoDisplayLEDs (88 pins), InfoDisplayAudio (6 pins), InfoDisplayPower (18 pins)
CAR_WakeSignal: InfoDisplay (HDR1.A5), InfoDisplayPower (R100.2)
LED_B_Battery: InfoDisplay (U1.50), InfoDisplayLEDs (Q26.2 R71.1)
LED_B_Braking: InfoDisplay (U1.58), InfoDisplayLEDs (Q41.2 R83.1)
LED_B_Charging: InfoDisplay (U1.67), InfoDisplayLEDs (Q25.2 R70.1)
LED_B_Clutch: InfoDisplay (U1.48), InfoDisplayLEDs (Q35.2 R78.1)
LED_B_Done: InfoDisplay (U1.74), InfoDisplayLEDs (Q48.2 R90.1)
LED_B_Energized: InfoDisplay (U1.63), InfoDisplayLEDs (Q34.2 R77.1)
LED_B_Engine: InfoDisplay (U1.9), InfoDisplayLEDs (Q17.2 R64.1)
LED_B_Fuel: InfoDisplay (U1.87), InfoDisplayLEDs (Q47.2 R89.1)
LED_B_Hybrid: InfoDisplay (U1.83), InfoDisplayLEDs (Q16.2 R63.1)
LED_B_Logging: InfoDisplay (U1.4), InfoDisplayLEDs (Q42.2 R84.1)
LED_B_Motor1: InfoDisplay (U1.96), InfoDisplayLEDs (Q53.2 R93.1)
LED_B_Motor2: InfoDisplay (U1.2 UART.1), InfoDisplayLEDs (Q8.2 R39.1)
LED_B_Ready: InfoDisplay (U1.81), InfoDisplayLEDs (Q7.2 R33.1)
LED_G_Battery: InfoDisplay (U1.49), InfoDisplayLEDs (Q23.2 R69.1)
LED_G_Braking: InfoDisplay (U1.59), InfoDisplayLEDs (Q39.2 R81.1)
LED_G_Charging: InfoDisplay (U1.66), InfoDisplayLEDs (Q22.2 R68.1)
LED_G_Clutch: InfoDisplay (U1.46), InfoDisplayLEDs (Q32.2 R76.1)
LED_G_Done: InfoDisplay (U1.68), InfoDisplayLEDs (Q46.2 R88.1)
LED_G_Economy: InfoDisplay (U1.8), InfoDisplayLEDs (Q6.2 R30.2)
LED_G_Energized: InfoDisplay (U1.62), InfoDisplayLEDs (Q31.2 R75.1)
LED_G_Engine: InfoDisplay (U1.15), InfoDisplayLEDs (Q14.2 R62.1)
LED_G_Fuel: InfoDisplay (U1.85), InfoDisplayLEDs (Q45.2 R87.1)
LED_G_Hybrid: InfoDisplay (U1.84), InfoDisplayLEDs (Q13.2 R61.1)
LED_G_Logging: InfoDisplay (U1.6), InfoDisplayLEDs (Q40.2 R82.1)
LED_G_Motor1: InfoDisplay (U1.94), InfoDisplayLEDs (Q51.2 R92.1)
LED_G_Motor2: InfoDisplay (U1.3), InfoDisplayLEDs (Q5.2 R24.1)
LED_G_Performance: InfoDisplay (U1.100), InfoDisplayLEDs (Q52.2 R94.2)
LED_G_Ready: InfoDisplay (U1.80), InfoDisplayLEDs (Q4.2 R21.1)
LED_R_Battery: InfoDisplay (U1.61), InfoDisplayLEDs (Q20.2 R66.1)
LED_R_Braking: InfoDisplay (U1.60), InfoDisplayLEDs (Q37.2 R79.1)
LED_R_Charging: InfoDisplay (U1.70), InfoDisplayLEDs (Q19.2 R65.1)
LED_R_Clutch: InfoDisplay (U1.54), InfoDisplayLEDs (Q29.2 R73.1)
LED_R_Done: InfoDisplay (U1.65), InfoDisplayLEDs (Q44.2 R86.1)
LED_R_Energized: InfoDisplay (U1.64), InfoDisplayLEDs (Q28.2 R72.1)
LED_R_Engine: InfoDisplay (U1.17 UART.2), InfoDisplayLEDs (Q11.2 R56.1)
LED_R_Fault: InfoDisplay (U1.88), InfoDisplayLEDs (Q12.2 R60.1)
LED_R_Fuel: InfoDisplay (U1.57), InfoDisplayLEDs (Q43.2 R85.1)
LED_R_Ground: InfoDisplay (U1.97), InfoDisplayLEDs (Q21.2 R67.1)
LED_R_Hybrid: InfoDisplay (U1.69), InfoDisplayLEDs (Q10.2 R42.1)
LED_R_Logging: InfoDisplay (U1.1), InfoDisplayLEDs (Q38.2 R80.1)
LED_R_Motor1: InfoDisplay (U1.92), InfoDisplayLEDs (Q49.2 R91.1)
LED_R_Motor2: InfoDisplay (U1.93), InfoDisplayLEDs (Q2.2 R15.1)
LED_R_Ready: InfoDisplay (U1.82), InfoDisplayLEDs (Q1.2 R9.1)
LED_R_Warning: InfoDisplay (U1.98), InfoDisplayLEDs (Q30.2 R74.1)
SOUND_Output: InfoDisplay (R99.2 U1.55), InfoDisplayAudio (R95.2)